# EAGLE design speed_controllers (EAGLE 8.6.1)
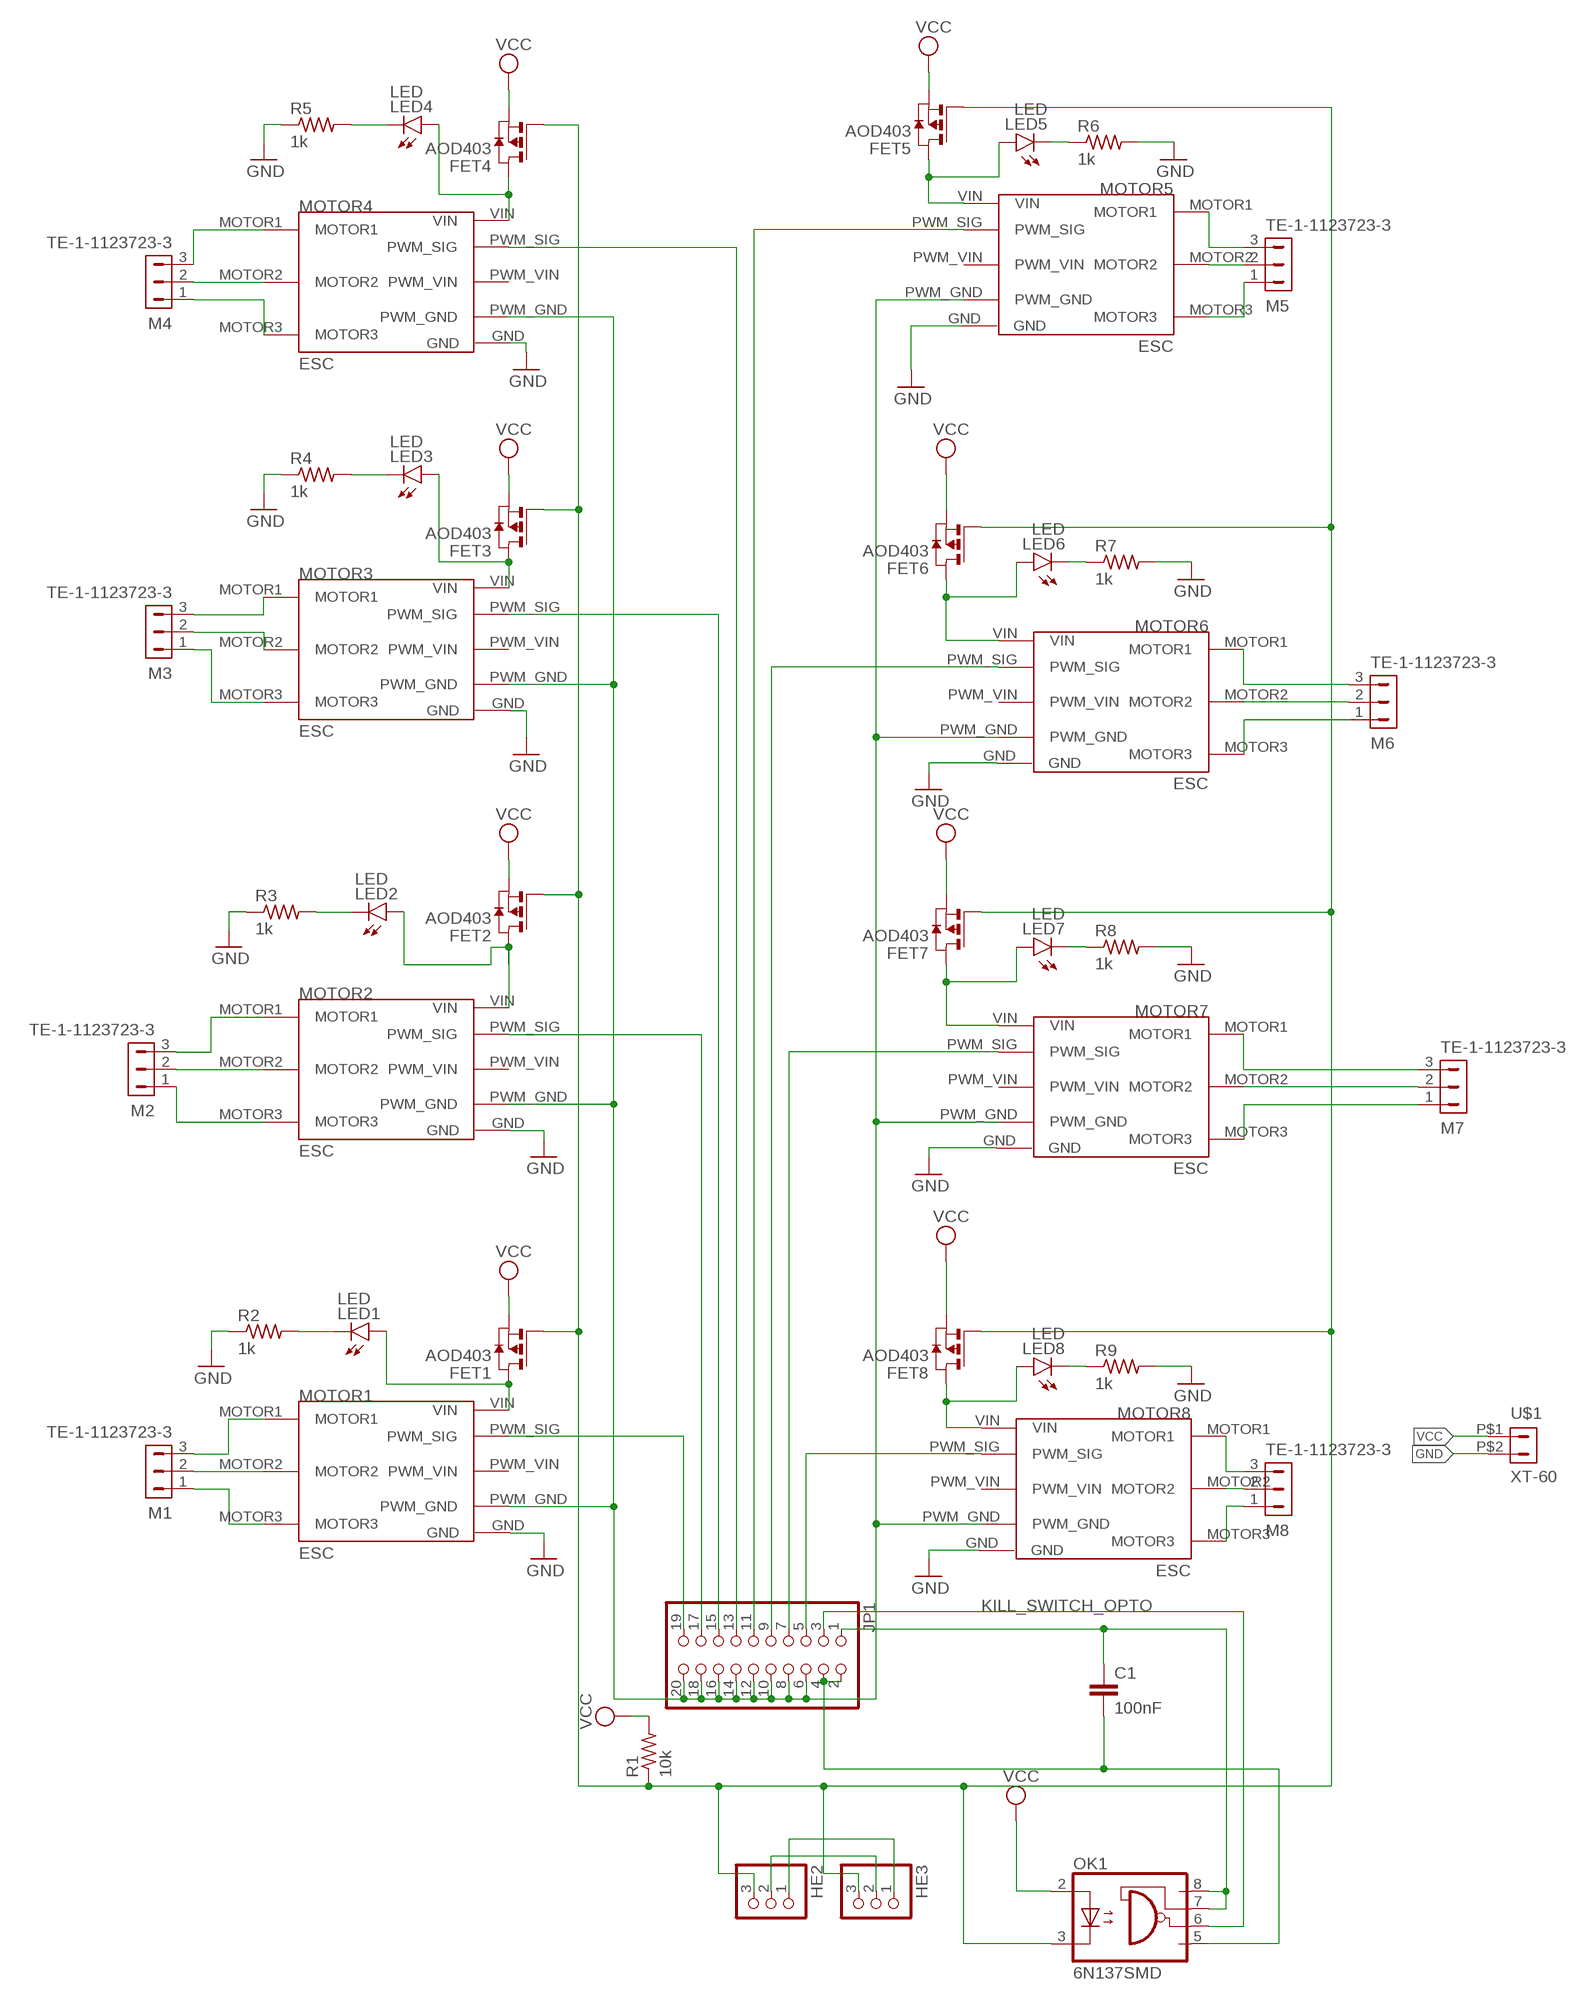
[diagram p0: schematic, sheet 1]

## Parts
C1  100nF  C-EUC0603  [C0603]
FET1  AOD403  [TO252]
FET2  AOD403  [TO252]
FET3  AOD403  [TO252]
FET4  AOD403  [TO252]
FET5  AOD403  [TO252]
FET6  AOD403  [TO252]
FET7  AOD403  [TO252]
FET8  AOD403  [TO252]
HE2  PINHD-1X3  [1X03]
HE3  PINHD-1X3  [1X03]
JP1  PINHD-2X10  [2X10]
LED1  LED  [LED-0603]
LED2  LED  [LED-0603]
LED3  LED  [LED-0603]
LED4  LED  [LED-0603]
LED5  LED  [LED-0603]
LED6  LED  [LED-0603]
LED7  LED  [LED-0603]
LED8  LED  [LED-0603]
M1  TE-1-1123723-3  [TE-1-1123723-3]
M2  TE-1-1123723-3  [TE-1-1123723-3]
M3  TE-1-1123723-3  [TE-1-1123723-3]
M4  TE-1-1123723-3  [TE-1-1123723-3]
M5  TE-1-1123723-3  [TE-1-1123723-3]
M6  TE-1-1123723-3  [TE-1-1123723-3]
M7  TE-1-1123723-3  [TE-1-1123723-3]
M8  TE-1-1123723-3  [TE-1-1123723-3]
MOTOR1  ESC  [ESC]
MOTOR2  ESC  [ESC]
MOTOR3  ESC  [ESC]
MOTOR4  ESC  [ESC]
MOTOR5  ESC  [ESC]
MOTOR6  ESC  [ESC]
MOTOR7  ESC  [ESC]
MOTOR8  ESC  [ESC]
OK1  6N137SMD  [DIL8-SMD]
R1  10k  R-US_R0603  [R0603]
R2  1k  R-US_R0603  [R0603]
R3  1k  R-US_R0603  [R0603]
R4  1k  R-US_R0603  [R0603]
R5  1k  R-US_R0603  [R0603]
R6  1k  R-US_R0603  [R0603]
R7  1k  R-US_R0603  [R0603]
R8  1k  R-US_R0603  [R0603]
R9  1k  R-US_R0603  [R0603]
U$1  XT-60  [XT-60]

## Nets
FET_G: FET1.G FET2.G FET3.G FET4.G FET5.G FET6.G FET7.G FET8.G HE2.3 HE3.3 OK1.3(C) R1.1
GND: HE2.2 HE3.2 MOTOR1.GND MOTOR2.GND MOTOR3.GND MOTOR4.GND MOTOR5.GND MOTOR6.GND MOTOR7.GND MOTOR8.GND R2.1 R3.1 R4.1 R5.1 R6.2 R7.2 R8.2 R9.2 U$1.P$2
KILL_SWITCH_OPTO: JP1.3 OK1.6(VO)
M1_1: M1.1 MOTOR1.MOTOR3
M1_2: M1.2 MOTOR1.MOTOR2
M1_3: M1.3 MOTOR1.MOTOR1
M2_1: M2.1 MOTOR2.MOTOR3
M2_2: M2.2 MOTOR2.MOTOR2
M2_3: M2.3 MOTOR2.MOTOR1
M3_1: M3.1 MOTOR3.MOTOR3
M3_2: M3.2 MOTOR3.MOTOR2
M3_3: M3.3 MOTOR3.MOTOR1
M4_1: M4.1 MOTOR4.MOTOR3
M4_2: M4.2 MOTOR4.MOTOR2
M4_3: M4.3 MOTOR4.MOTOR1
M5_1: M5.1 MOTOR5.MOTOR3
M5_2: M5.2 MOTOR5.MOTOR2
M5_3: M5.3 MOTOR5.MOTOR1
M6_1: M6.1 MOTOR6.MOTOR3
M6_2: M6.2 MOTOR6.MOTOR2
M6_3: M6.3 MOTOR6.MOTOR1
M7_1: M7.1 MOTOR7.MOTOR3
M7_2: M7.2 MOTOR7.MOTOR2
M7_3: M7.3 MOTOR7.MOTOR1
M8_1: M8.1 MOTOR8.MOTOR3
M8_2: M8.2 MOTOR8.MOTOR2
M8_3: M8.3 MOTOR8.MOTOR1
MCU_GND: C1.2 JP1.2 JP1.4 OK1.5(GND)
MCU_VCC: C1.1 JP1.1 OK1.7(VE) OK1.8(VCC)
N$6: LED1.C R2.2
N$7: LED2.C R3.2
N$8: LED3.C R4.2
N$9: LED4.C R5.2
N$11: LED5.C R6.1
N$12: LED7.C R8.1
N$13: LED8.C R9.1
PWM_GND: JP1.6 JP1.8 JP1.10 JP1.12 JP1.14 JP1.16 JP1.18 JP1.20 MOTOR1.PWM_GND MOTOR2.PWM_GND MOTOR3.PWM_GND MOTOR4.PWM_GND MOTOR5.PWM_GND MOTOR6.PWM_GND MOTOR7.PWM_GND MOTOR8.PWM_GND
R7: LED6.C R7.1
SIG_1: JP1.19 MOTOR1.PWM_SIG
SIG_2: JP1.17 MOTOR2.PWM_SIG
SIG_3: JP1.15 MOTOR3.PWM_SIG
SIG_4: JP1.13 MOTOR4.PWM_SIG
SIG_5: JP1.11 MOTOR5.PWM_SIG
SIG_6: JP1.9 MOTOR6.PWM_SIG
SIG_7: JP1.7 MOTOR7.PWM_SIG
SIG_8: JP1.5 MOTOR8.PWM_SIG
VCC: FET1.S FET2.S HE2.1 HE3.1 OK1.2(A) R1.2 U$1.P$1
VIN3: FET3.D LED3.A MOTOR3.VIN
VIN_1: FET1.D LED1.A MOTOR1.VIN
VIN_2: FET2.D LED2.A MOTOR2.VIN
VIN_4: FET4.D LED4.A MOTOR4.VIN
VIN_5: FET5.D LED5.A MOTOR5.VIN
VIN_6: FET6.D LED6.A MOTOR6.VIN
VIN_7: FET7.D LED7.A MOTOR7.VIN
VIN_8: FET8.D LED8.A MOTOR8.VIN
Unconnected: FET3.S FET4.S FET5.S FET6.S FET7.S FET8.S MOTOR1.PWM_VIN MOTOR2.PWM_VIN MOTOR3.PWM_VIN MOTOR4.PWM_VIN MOTOR5.PWM_VIN MOTOR6.PWM_VIN MOTOR7.PWM_VIN MOTOR8.PWM_VIN

## Library data of the parts
C1 = rcl:C-EU: CAPACITOR, European symbol; SPICEPREFIX: C
FET1-FET8 = auv:AOD403
HE2 HE3 = auv:PINHD-1X3: PIN HEADER
JP1 = auv:PINHD-2X10: PIN HEADER
LED1-LED8 = auv:LED
M1-M8 = auv:TE-1-1123723-3
MOTOR1-MOTOR8 = auv:ESC
OK1 = auv:6N137: MOTOROLA OPTO COUPLER
R1-R9 = auv:R-US_: RESISTOR, American symbol
U$1 = auv:XT-60

## Board
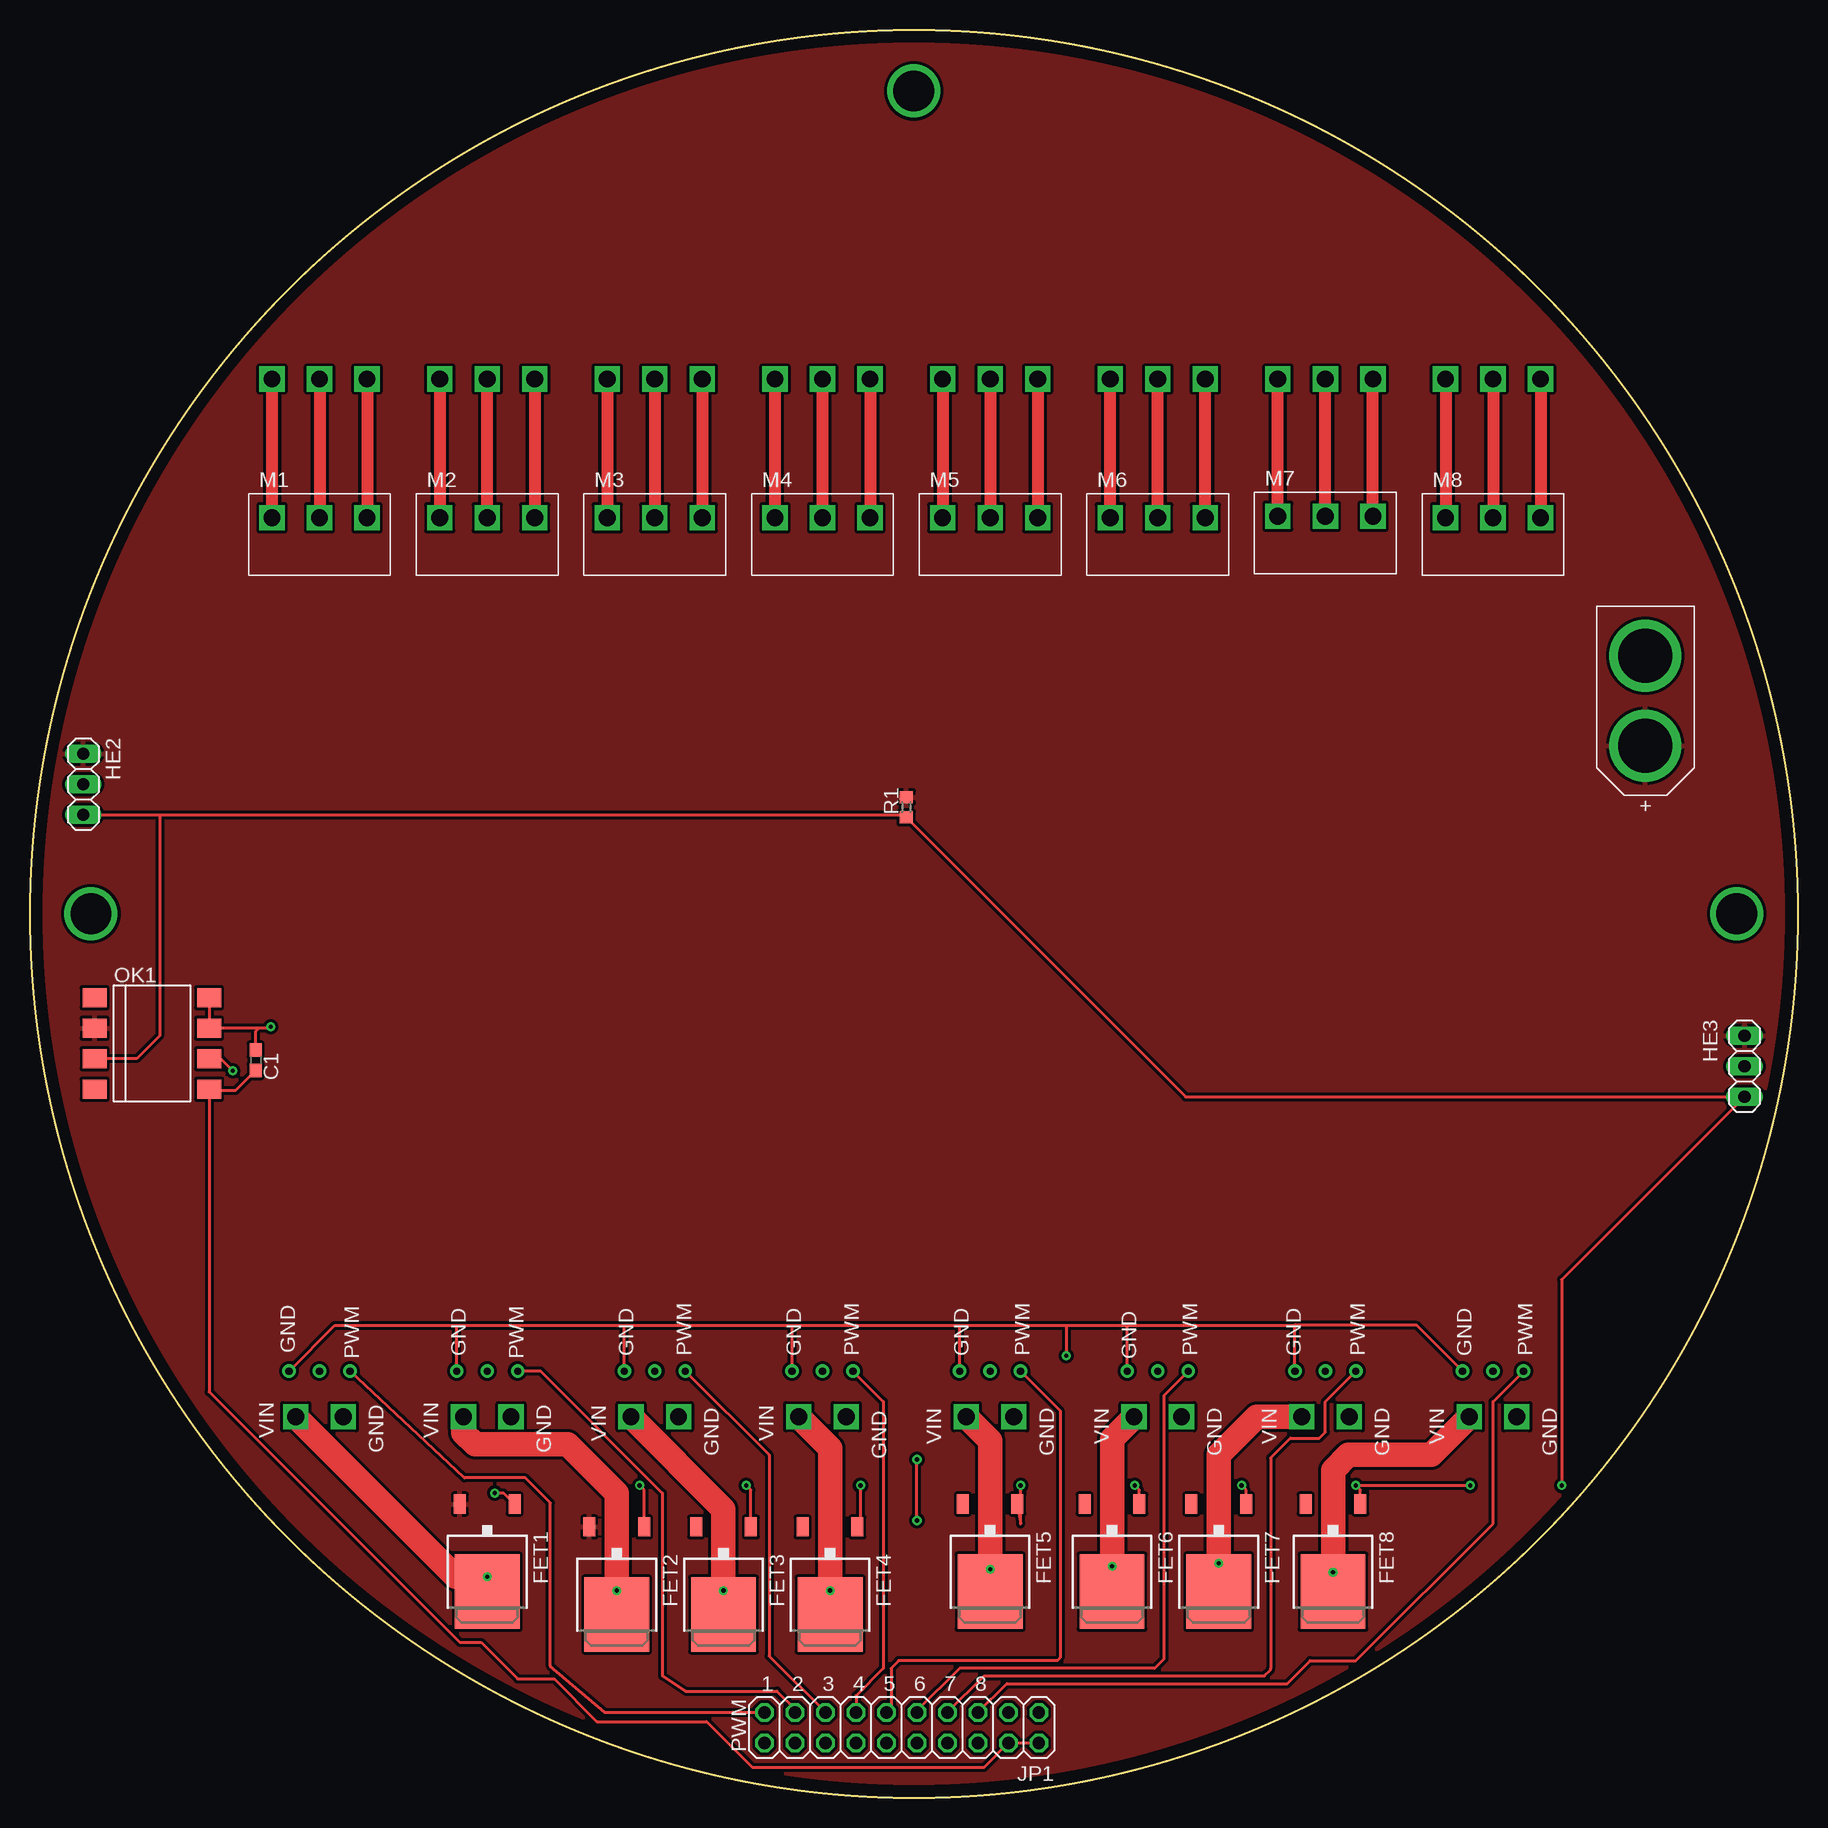
[diagram p1: board, top side]
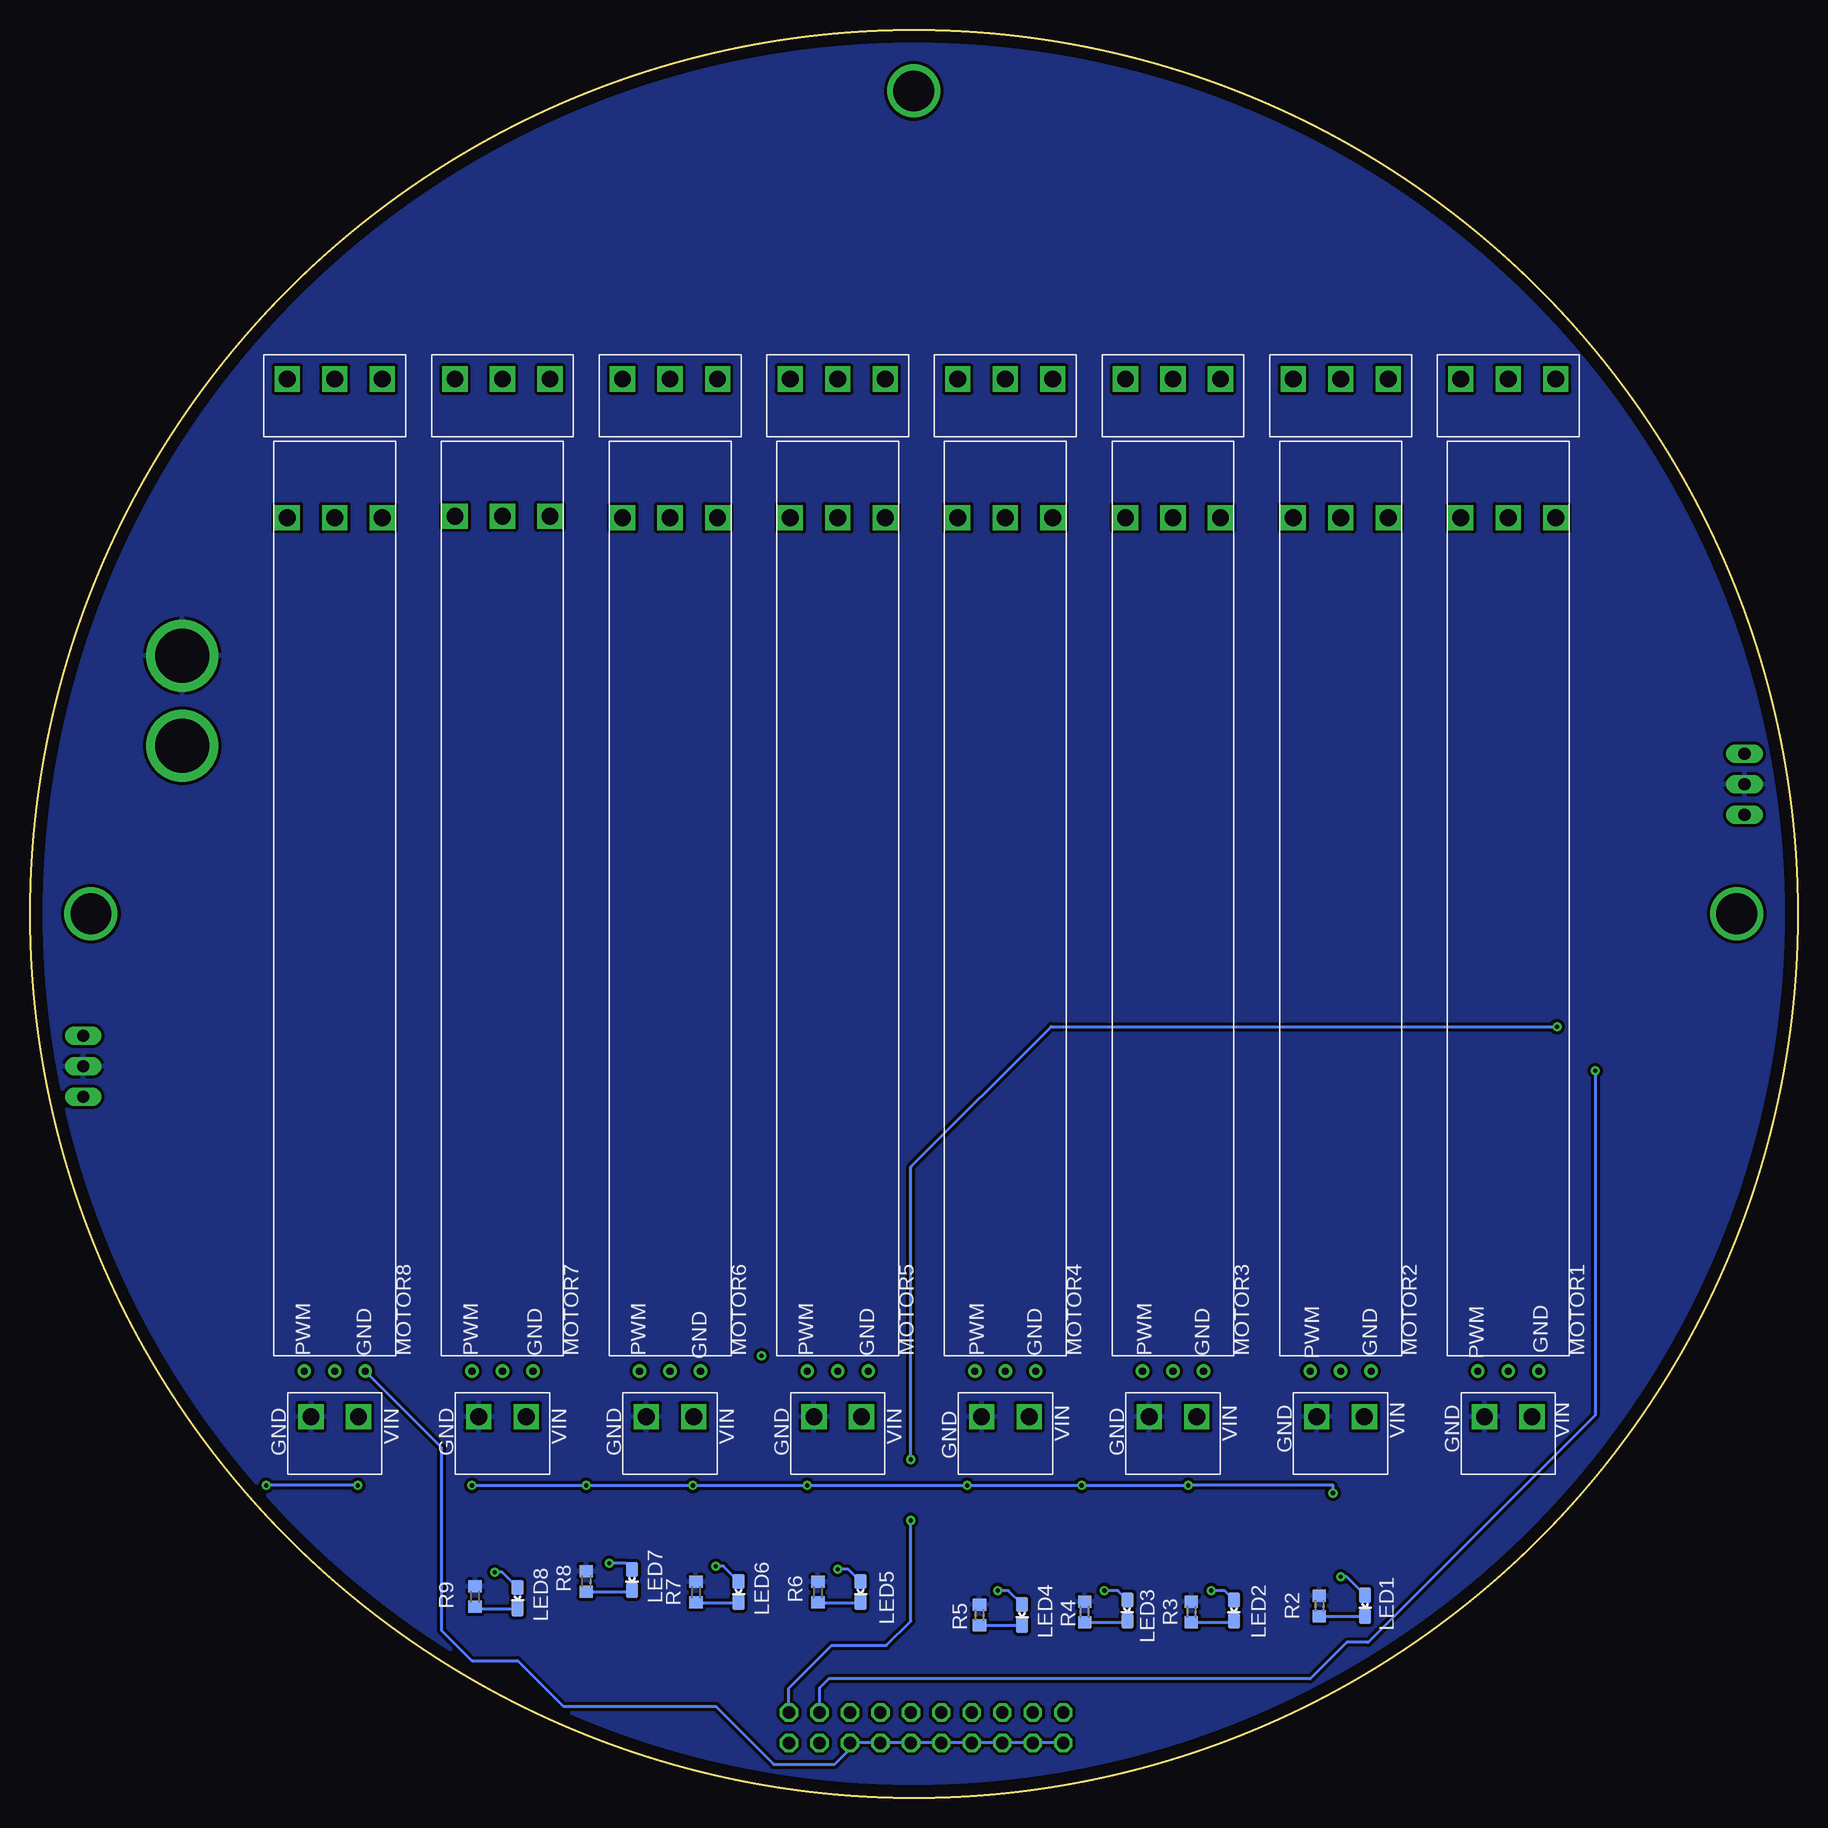
[diagram p2: board, bottom side, seen from below]

Size 147.32 x 147.32 mm. Coordinates in mm from the lower left corner, seen from the top.
Outline: circle at 73.66,73.66 radius 73.66
Copper layers (1*16): Top 0.035mm / dielectric 1.5mm / Bottom 0.035mm
Design rules "PCBway": minimum track width 6mil, minimum drill 0.3mm, track to track 0.205mm, track to pad 0.205mm, pad to pad 0.205mm, via to via 0.205mm, smd to smd 8mil, copper to edge 40mil, drill to drill 8mil, minimum pad ring 10mil, minimum via ring 8mil, stop-mask expansion 4mil, vias tented up to drill 25mil, thermal gap 10mil

### Footprints (pad centres in the part's own frame; a part is rotated, then mirrored left to right if it is on the bottom)
C0603 = smd 1.1 x 1: 1 -0.85,0; 2 0.85,0
TO252 = smd 5.4 x 6.2: D 0,2.5 | smd 1 x 1.6: G -2.28,-4.8; S 2.28,-4.8
1X03 = drill 1.016 long: 1 -2.54,0; 2 0,0; 3 2.54,0
2X10 = drill 1.016 octagon: 1 -11.43,-1.27; 2 -11.43,1.27; 3 -8.89,-1.27; 4 -8.89,1.27; 5 -6.35,-1.27; 6 -6.35,1.27; 7 -3.81,-1.27; 8 -3.81,1.27; 9 -1.27,-1.27; 10 -1.27,1.27; 11 1.27,-1.27; 12 1.27,1.27; 13 3.81,-1.27; 14 3.81,1.27; 15 6.35,-1.27; 16 6.35,1.27; 17 8.89,-1.27; 18 8.89,1.27; 19 11.43,-1.27; 20 11.43,1.27
LED-0603 = smd 1.016 x 1.27: A 0,-0.877; C 0,0.877
TE-1-1123723-3 = drill 1.4 square: 1 -3.96,0; 2 0,0; 3 3.96,0
ESC = drill 1.4 square: GND -1.98,-43.18; MOTOR1 -3.96,43.307; MOTOR2 0,43.307; MOTOR3 3.96,43.307; VIN 1.98,-43.18 | drill 0.6: PWM_GND 2.54,-39.37; PWM_SIG -2.54,-39.37; PWM_VIN 0,-39.37
DIL8-SMD = smd 1.6 x 2: 1 -3.81,-4.77; 2 -1.27,-4.77; 3 1.27,-4.77; 4 3.81,-4.77; 5 3.81,4.77; 6 1.27,4.77; 7 -1.27,4.77; 8 -3.81,4.77
R0603 = smd 1 x 1.1: 1 -0.85,0; 2 0.85,0
XT-60 = drill 4.5 pad 6: P$1 -3.75,0; P$2 3.75,0

### Placement (x,y rotation side)
C1  18.8,61.47 270 top
FET1  38.1,19.68 180 top
FET2  48.89,17.78 180 top
FET3  57.78,17.78 180 top
FET4  66.67,17.78 180 top
FET5  80.01,19.68 180 top
FET6  90.17,19.68 180 top
FET7  99.06,19.68 180 top
FET8  108.58,19.68 180 top
HE2  4.44,84.45 270 top
HE3  142.88,60.96 270 top
JP1  72.64,5.84 180 top
LED1  36.07,16 180 bottom
LED2  46.99,15.62 180 bottom
LED3  55.88,15.62 180 bottom
LED4  64.64,15.24 180 bottom
LED5  78.1,17.14 180 bottom
LED6  88.27,17.14 180 bottom
LED7  97.16,18.16 180 bottom
LED8  106.68,16.64 180 bottom
M1  24.13,106.68 0 top
M2  38.1,106.68 0 top
M3  52.07,106.68 0 top
M4  66.04,106.68 0 top
M5  80.01,106.68 0 top
M6  93.98,106.68 0 top
M7  107.95,106.81 0 top
M8  121.92,106.68 0 top
MOTOR1  24.13,74.93 0 bottom
MOTOR2  38.1,74.93 0 bottom
MOTOR3  52.07,74.93 0 bottom
MOTOR4  66.04,74.93 0 bottom
MOTOR5  80.01,74.93 0 bottom
MOTOR6  93.98,74.93 0 bottom
MOTOR7  107.95,74.93 0 bottom
MOTOR8  121.92,74.93 0 bottom
OK1  10.16,62.86 270 top
R1  73.02,82.55 90 top
R2  39.88,16 270 bottom
R3  50.55,15.49 270 bottom
R4  59.44,15.49 270 bottom
R5  68.2,15.24 270 bottom
R6  81.66,17.14 90 bottom
R7  91.82,17.14 90 bottom
R8  100.97,18.03 90 bottom
R9  110.24,16.76 90 bottom
U$1  134.62,91.44 90 top

### Tracks (layer width: path | path; a pad name or v marks a point on that pad's centre or on a via)
FET_G  (via drill 0.35)
  Top 0.254: HE2.3 10.79,81.91 | 10.79,81.91 72.81,81.91 R1.1 96.3,58.42 HE3.3 127.63,43.18 v127.63,26.03 | FET3.G 60.06,25.66 v59.69,26.03 | FET4.G 69.22,22.84 v69.22,26.03 | FET5.G 82.55,22.84 v82.55,26.03 | FET6.G 92.45,25.66 v92.07,26.03 | FET7.G 101.34,25.66 v100.97,26.03 | FET8.G 110.86,25.66 v110.49,26.03 v120.01,26.03 | 10.79,81.91 10.79,63.5 8.89,61.59 OK1.3 | FET2.G 51.17,25.66 v50.8,26.03 | FET1.G 39.46,25.4 v38.73,25.4
  Bottom 0.254: v110.49,26.03 v100.97,26.03 v92.07,26.03 v82.55,26.03 v69.22,26.03 v59.69,26.03 v50.8,26.03 38.73,26.03 v38.73,25.4 | v120.01,26.03 v127.63,26.03
GND
  pour Bottom (isolate 0.254): 149.86,149.86 -2.54,149.86 -2.54,-2.54 149.86,-2.54
KILL_SWITCH_OPTO  (via drill 0.35)
  Top 0.254: OK1.6 15.88,61.59 v16.89,60.58 17.02,60.45
  Bottom 0.254: JP1.3 81.53,9.14 80.77,9.91 40.64,9.91 37.59,12.95 35.81,12.95 16.89,31.88 v16.89,60.58
M1_1
  Top 1.016: M1.1 MOTOR1.MOTOR3
M1_2
  Top 1.016: MOTOR1.MOTOR2 M1.2
M1_3
  Top 1.016: MOTOR1.MOTOR1 M1.3
M2_1
  Top 1.016: MOTOR2.MOTOR3 M2.1
M2_2
  Top 1.016: M2.2 MOTOR2.MOTOR2
M2_3
  Top 1.016: MOTOR2.MOTOR1 M2.3
M3_1
  Top 1.016: MOTOR3.MOTOR3 M3.1
M3_2
  Top 1.016: MOTOR3.MOTOR2 M3.2
M3_3
  Top 1.016: MOTOR3.MOTOR1 M3.3
M4_1
  Top 1.016: MOTOR4.MOTOR3 M4.1
M4_2
  Top 1.016: MOTOR4.MOTOR2 M4.2
M4_3
  Top 1.016: MOTOR4.MOTOR1 M4.3
M5_1
  Top 1.016: MOTOR5.MOTOR3 M5.1
M5_2
  Top 1.016: MOTOR5.MOTOR2 M5.2
M5_3
  Top 1.016: MOTOR5.MOTOR1 M5.3
M6_1
  Top 1.016: M6.1 MOTOR6.MOTOR3
M6_2
  Top 1.016: M6.2 MOTOR6.MOTOR2
M6_3
  Top 1.016: M6.3 MOTOR6.MOTOR1
M7_1
  Top 1.016: M7.1 MOTOR7.MOTOR3
M7_2
  Top 1.016: M7.2 MOTOR7.MOTOR2
M7_3
  Top 1.016: M7.3 MOTOR7.MOTOR1
M8_1
  Top 1.016: MOTOR8.MOTOR3 M8.1
M8_2
  Top 1.016: MOTOR8.MOTOR2 M8.2
M8_3
  Top 1.016: MOTOR8.MOTOR1 M8.3
MCU_GND
  Top 0.254: OK1.5 14.93,58.93 | 14.93,58.93 14.93,33.84 35.81,12.95 37.59,12.95 40.64,9.91 43.69,9.91 47.24,6.35 56.39,6.35 60.2,2.54 79.5,2.54 JP1.4 JP1.2 | C1.2 17.11,58.93 14.93,58.93
MCU_VCC  (via drill 0.35)
  Top 0.254: OK1.8 OK1.7 19.05,64.13 | v20.07,64.26 19.94,64.13 19.05,64.13 | v73.91,23.11 v73.91,28.19 | C1.1 18.8,63.88 19.05,64.13
  Bottom 0.254: JP1.1 84.07,9.14 80.52,12.7 75.95,12.7 73.91,14.73 v73.91,23.11 | v73.91,28.19 73.91,52.58 62.23,64.26 v20.07,64.26
N$1  (via drill 3.4)
  other vias: 142.24,73.66
N$2  (via drill 3.4)
  other vias: 73.66,142.24
N$3  (via drill 3.4)
  other vias: 5.08,73.66
N$6
  Bottom 0.254: R2.2 36.09,15.15 LED1.C
N$7
  Bottom 0.254: R3.2 47.09,14.64 LED2.C
N$8
  Bottom 0.254: R4.2 55.98,14.64 LED3.C
N$9
  Bottom 0.254: R5.2 64.67,14.39 LED4.C
N$11
  Bottom 0.254: R6.1 81.63,16.27 LED5.C
N$12
  Bottom 0.254: R8.1 97.25,17.18 LED7.C
N$13
  Bottom 0.254: R9.1 110.08,15.76 LED8.C
PWM_GND  (via drill 0.35)
  Top 0.254: MOTOR1.PWM_GND 25.4,39.37 35.56,39.37 | 35.56,39.37 49.53,39.37 | 49.53,39.37 63.5,39.37 | 63.5,39.37 77.47,39.37 | 77.47,39.37 86.36,39.37 | 86.36,39.37 91.44,39.37 | 91.44,39.37 105.41,39.37 | 105.41,39.37 115.57,39.37 MOTOR8.PWM_GND | MOTOR4.PWM_GND 63.5,39.37 | MOTOR3.PWM_GND 49.53,39.37 | MOTOR2.PWM_GND 35.56,39.37 | 86.36,39.37 v86.36,36.83 | MOTOR5.PWM_GND 77.47,39.37 | MOTOR6.PWM_GND 91.44,39.37 | MOTOR7.PWM_GND 105.41,39.37
  Bottom 0.254: MOTOR8.PWM_GND 113.03,29.21 113.03,13.97 110.49,11.43 106.68,11.43 102.87,7.62 90.17,7.62 85.34,2.79 80.26,2.79 78.99,4.06 JP1.6 JP1.8 JP1.10 JP1.12 JP1.14 JP1.16 JP1.18 JP1.20
R7
  Bottom 0.254: R7.1 91.79,16.27 LED6.C
SIG_1
  Top 0.254: MOTOR1.PWM_SIG 36.19,26.67 41.27,26.67 43.37,24.57 43.37,10.98 47.88,7.11 JP1.19
SIG_2
  Top 0.254: JP1.17 63.75,7.37 62.23,8.89 54.61,8.89 52.7,10.16 52.7,25.4 42.55,35.56 MOTOR2.PWM_SIG
SIG_3
  Top 0.254: MOTOR3.PWM_SIG 61.59,28.57 61.59,11.81 JP1.15
SIG_4
  Top 0.254: MOTOR4.PWM_SIG 71.12,33.02 71.12,10.79 68.83,8.51 JP1.13 68.58,7.37
SIG_5
  Top 0.254: MOTOR5.PWM_SIG 85.85,32.26 85.85,11.68 85.6,11.43 72.39,11.43 71.75,10.79 71.75,7.49 JP1.11
SIG_6
  Top 0.254: MOTOR6.PWM_SIG 94.49,33.53 94.49,11.56 93.73,10.79 77.47,10.79 73.91,7.24 JP1.9
SIG_7
  Top 0.254: MOTOR7.PWM_SIG 107.95,33.02 107.95,30.48 107.44,29.97 105.03,29.97 103.38,28.32 103.38,10.79 103.38,10.67 102.87,10.16 79.5,10.16 JP1.7
SIG_8
  Top 0.254: MOTOR8.PWM_SIG 121.92,33.02 121.92,22.86 110.49,11.43 106.68,11.43 104.77,9.52 81.41,9.52 JP1.5
VCC
  pour Top (isolate 0.254): -2.54,149.86 149.86,149.86 149.86,-2.54 -2.54,-2.54
VIN3  (via drill 0.35)
  Top 2.032: FET3.D v57.78,17.27 57.78,24.05 MOTOR3.VIN
  Bottom 0.254: LED3.A 56.65,17.27 v57.78,17.27
VIN_1  (via drill 0.35)
  Top 2.032: MOTOR1.VIN 35.48,18.41 v38.1,18.41 FET1.D
  Bottom 0.254: LED1.A 37.6,18.41 v38.1,18.41
VIN_2  (via drill 0.35)
  Top 2.032: FET2.D v48.89,17.27 48.89,25.4 44.83,29.46 37.08,29.46 36.12,30.43 MOTOR2.VIN
  Bottom 0.254: LED2.A 47.76,17.27 v48.89,17.27
VIN_4  (via drill 0.35)
  Top 2.032: FET4.D v66.67,17.27 66.67,29.13 MOTOR4.VIN
  Bottom 0.254: LED4.A 65.8,17.27 v66.67,17.27
VIN_5  (via drill 0.35)
  Top 2.032: FET5.D v80.01,19.05 80.01,29.77 MOTOR5.VIN
  Bottom 0.254: LED5.A 79.13,19.05 v80.01,19.05
VIN_6  (via drill 0.35)
  Top 2.032: FET6.D v90.17,19.3 90.17,29.92 MOTOR6.VIN
  Bottom 0.254: LED6.A 89.55,19.3 v90.17,19.3
VIN_7  (via drill 0.35)
  Top 2.032: FET7.D v99.06,19.56 99.06,28.57 102.23,31.75 MOTOR7.VIN
  Bottom 0.254: LED7.A 97.67,19.56 v99.06,19.56
VIN_8  (via drill 0.35)
  Top 2.032: FET8.D v108.58,18.8 108.58,27.3 109.85,28.57 116.76,28.57 MOTOR8.VIN
  Bottom 0.254: LED8.A 107.96,18.8 v108.58,18.8

### Text on the board
tNames: + | GND | PWM | GND | PWM | GND | PWM | GND | PWM | GND | PWM | GND | PWM | GND | PWM | GND | PWM | VIN | GND | VIN | GND | VIN | GND | VIN | GND | VIN | GND | VIN | GND | VIN | GND | VIN | GND | 1 | 2 | 3 | 4 | 5 | 6 | 7 | 8 | PWM
bNames: GND | PWM | GND | PWM | GND | PWM | GND | PWM | GND | PWM | GND | PWM | GND | PWM | GND | PWM | VIN | GND | VIN | GND | VIN | GND | VIN | GND | VIN | GND | VIN | GND | VIN | GND | VIN | GND